# EAGLE design Smart Light Panel4 (EAGLE 8.4.3)
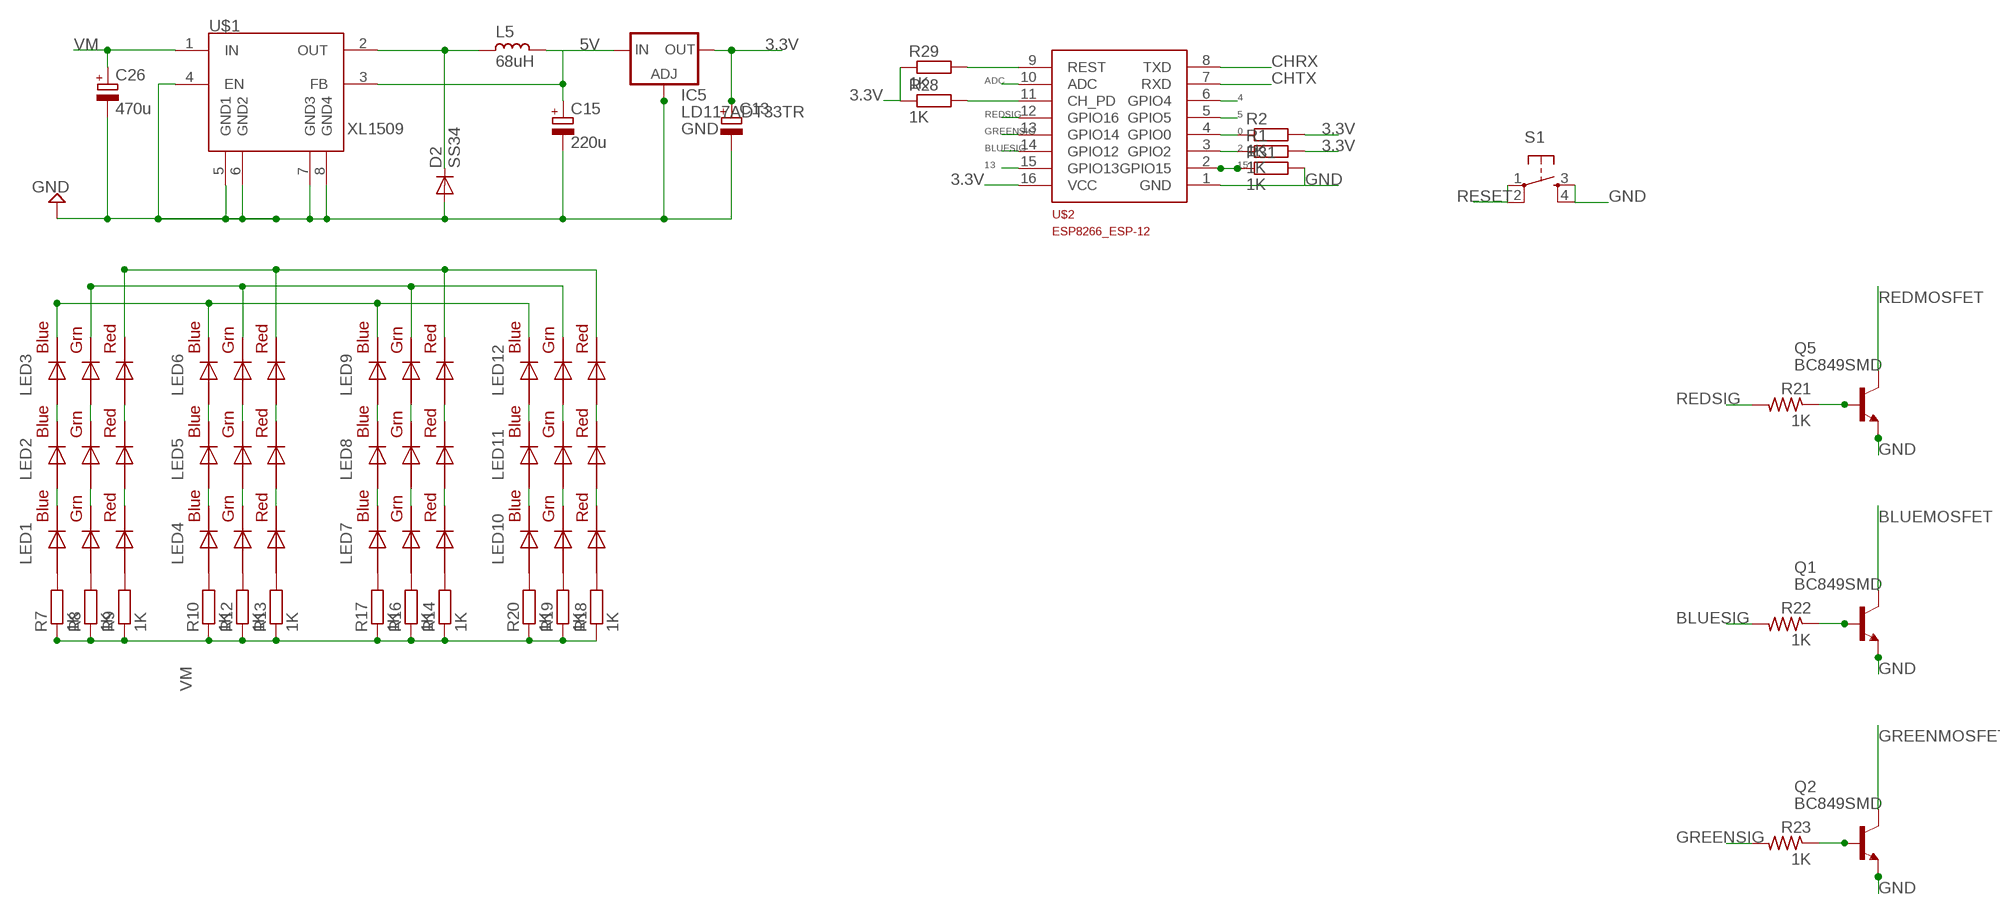
[diagram p0: schematic, sheet 1]

## Parts
C13  CPOL-EUE2.5-7  [E2,5-7]
C15  220u  CPOL-EUE2.5-7  [E2,5-7]
C26  470u  CPOL-EUE2.5-7  [E2,5-7]
D2  SS34  DIODE-DO-214AC  [DO-214AC]
IC5  LD117ADT33TR  [DPACK]
L5  68uH  L_CD75  [CD75]
LED1  RGBLED5050  [RGBLED5050]
LED2  RGBLED5050  [RGBLED5050]
LED3  RGBLED5050  [RGBLED5050]
LED4  RGBLED5050  [RGBLED5050]
LED5  RGBLED5050  [RGBLED5050]
LED6  RGBLED5050  [RGBLED5050]
LED7  RGBLED5050  [RGBLED5050]
LED8  RGBLED5050  [RGBLED5050]
LED9  RGBLED5050  [RGBLED5050]
LED10  RGBLED5050  [RGBLED5050]
LED11  RGBLED5050  [RGBLED5050]
LED12  RGBLED5050  [RGBLED5050]
Q1  BC849SMD  [SOT23-BEC]
Q2  BC849SMD  [SOT23-BEC]
Q5  BC849SMD  [SOT23-BEC]
R1  1K  R-EU_M1206  [M1206]
R2  1K  R-EU_M1206  [M1206]
R7  1K  R-EU_R1206  [R1206]
R8  1K  R-EU_R1206  [R1206]
R9  1K  R-EU_R1206  [R1206]
R10  1K  R-EU_R1206  [R1206]
R12  1K  R-EU_R1206  [R1206]
R13  1K  R-EU_R1206  [R1206]
R14  1K  R-EU_R1206  [R1206]
R16  1K  R-EU_R1206  [R1206]
R17  1K  R-EU_R1206  [R1206]
R18  1K  R-EU_R1206  [R1206]
R19  1K  R-EU_R1206  [R1206]
R20  1K  R-EU_R1206  [R1206]
R21  1K  R-US_M1206  [M1206]
R22  1K  R-US_M1206  [M1206]
R23  1K  R-US_M1206  [M1206]
R28  1K  R-EU_M1206  [M1206]
R29  1K  R-EU_M1206  [M1206]
R31  1K  R-EU_M1206  [M1206]
S1  TAC_SWITCHPTH  [TACTILE-PTH]
U$1  XL1509  [SO08]
U$2  ESP8266_ESP-12  [ESP8266-ESP12]

## Nets
0: R2.1 U$2.4(GPIO0)
2: R1.1 U$2.3(GPIO2)
3.3V: C13.+ IC5.4(OUT) R1.2 R2.2 R28.1 R29.1 U$2.16(VCC)
4: U$2.6(GPIO4)
5: U$2.5(GPIO5)
5V: C15.+ IC5.3(IN) L5.1 U$1.3(FB)
13: U$2.15(GPIO13)
15: R31.1 U$2.2(GPIO15)
ADC: U$2.10(ADC)
BLUEMOSFET: LED3.4(BLUE_C) LED6.4(BLUE_C) LED9.4(BLUE_C) LED12.4(BLUE_C) Q1.C
BLUESIG: R22.2 U$2.14(GPIO12)
CHRX: U$2.8(TXD)
CHTX: U$2.7(RXD)
GND: C13.- C15.- C26.- D2.2(A) IC5.1(ADJ) Q1.E Q2.E Q5.E R31.2 S1.3 S1.4 U$1.4(EN) U$1.5(GND1) U$1.6(GND2) U$1.7(GND3) U$1.8(GND4) U$2.1(GND)
GREENMOSFET: LED3.6(GREEN_C) LED6.6(GREEN_C) LED9.6(GREEN_C) LED12.6(GREEN_C) Q2.C
GREENSIG: R23.2 U$2.13(GPIO14)
N$2: LED2.4(BLUE_C) LED3.3(BLUE_A)
N$3: LED2.6(GREEN_C) LED3.1(GREEN_A)
N$5: Q1.B R22.1
N$6: LED2.5(RED_C) LED3.2(RED_A)
N$7: LED1.5(RED_C) LED2.2(RED_A)
N$8: Q2.B R23.1
N$11: LED1.6(GREEN_C) LED2.1(GREEN_A)
N$14: LED1.4(BLUE_C) LED2.3(BLUE_A)
N$15: LED4.4(BLUE_C) LED5.3(BLUE_A)
N$16: LED4.6(GREEN_C) LED5.1(GREEN_A)
N$17: LED5.4(BLUE_C) LED6.3(BLUE_A)
N$18: R28.2 U$2.11(CH_PD)
N$19: LED5.6(GREEN_C) LED6.1(GREEN_A)
N$20: LED4.5(RED_C) LED5.2(RED_A)
N$21: LED5.5(RED_C) LED6.2(RED_A)
N$22: LED7.4(BLUE_C) LED8.3(BLUE_A)
N$23: LED8.4(BLUE_C) LED9.3(BLUE_A)
N$24: LED7.6(GREEN_C) LED8.1(GREEN_A)
N$25: LED8.6(GREEN_C) LED9.1(GREEN_A)
N$26: LED7.5(RED_C) LED8.2(RED_A)
N$27: LED8.5(RED_C) LED9.2(RED_A)
N$28: LED10.4(BLUE_C) LED11.3(BLUE_A)
N$29: LED11.4(BLUE_C) LED12.3(BLUE_A)
N$30: LED10.6(GREEN_C) LED11.1(GREEN_A)
N$31: LED11.6(GREEN_C) LED12.1(GREEN_A)
N$32: LED10.5(RED_C) LED11.2(RED_A)
N$33: LED11.5(RED_C) LED12.2(RED_A)
N$42: Q5.B R21.1
N$92: D2.1(C) L5.2 U$1.2(OUT)
N$177: LED1.3(BLUE_A) R7.2
N$178: LED1.1(GREEN_A) R8.2
N$179: LED1.2(RED_A) R9.2
N$180: LED4.3(BLUE_A) R10.2
N$181: LED4.1(GREEN_A) R12.2
N$182: LED4.2(RED_A) R13.2
N$183: LED7.2(RED_A) R14.2
N$184: LED7.1(GREEN_A) R16.2
N$185: LED7.3(BLUE_A) R17.2
N$186: LED10.2(RED_A) R18.2
N$187: LED10.1(GREEN_A) R19.2
N$188: LED10.3(BLUE_A) R20.2
REDMOSFET: LED3.5(RED_C) LED6.5(RED_C) LED9.5(RED_C) LED12.5(RED_C) Q5.C
REDSIG: R21.2 U$2.12(GPIO16)
RESET: R29.2 S1.1 S1.2 U$2.9(REST)
VM: C26.+ R7.1 R8.1 R9.1 R10.1 R12.1 R13.1 R14.1 R16.1 R17.1 R18.1 R19.1 R20.1 U$1.1(IN)

## Library data of the parts
C13 C15 C26 = rcl:CPOL-EU: POLARIZED CAPACITOR, European symbol
D2 = dp_devices:DIODE: Various Diode Packages
IC5 = v-reg:LD117A?*: Low drop fixed and adjustable positive voltage regulators 1 A Source: http://www.st.com/stonline/products/literature/ds/7194/ld1117axx.pdf
L5 = rc-master-smd:L_: INDUCTOR
LED1-LED12 = adafruit:RGBLED: For 5050 RGB LEDs, the order of the LEDs may vary from one manufacturer to another!
Q1 Q2 Q5 = transistor-npn:BC849*: NPN Transistor
R1 R2 R7-R10 R12-R14 R16-R20 R28 R29 R31 = rcl:R-EU_: RESISTOR, European symbol
R21-R23 = adafruit:R-US_: RESISTOR, American symbol
S1 = SparkFun:TAC_SWITCH: Momentary Switch Button commonly used for reset or general input. Spark Fun Electronics SKU : COM-00097
U$1 = Cohesion_parts:XL1509
U$2 = ESP8266-ESP12:ESP8266_ESP-12: ESP8266 ESP-12 Discussion about pins here: http://www.esp8266.com/viewtopic.php?f=13&t=1429

## Net classes
1 power: width 0.6 mm, clearance 0.305 mm

## Board
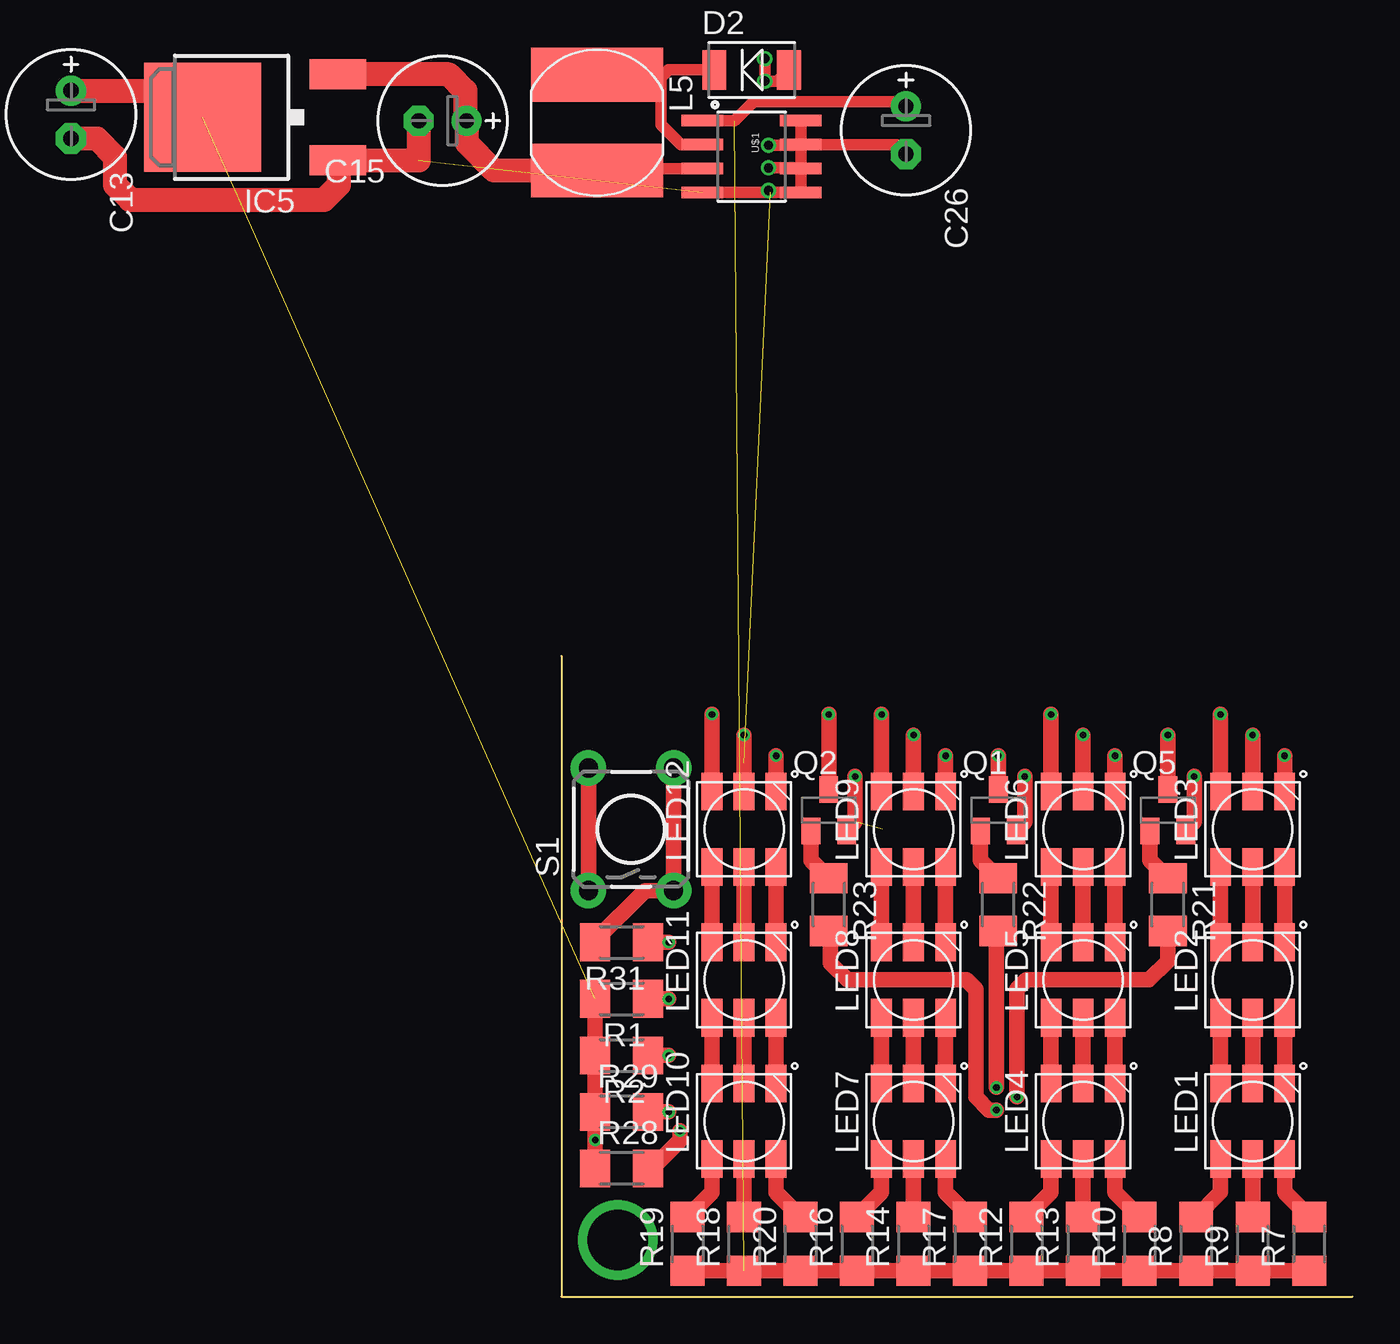
[diagram p1: board, top side]
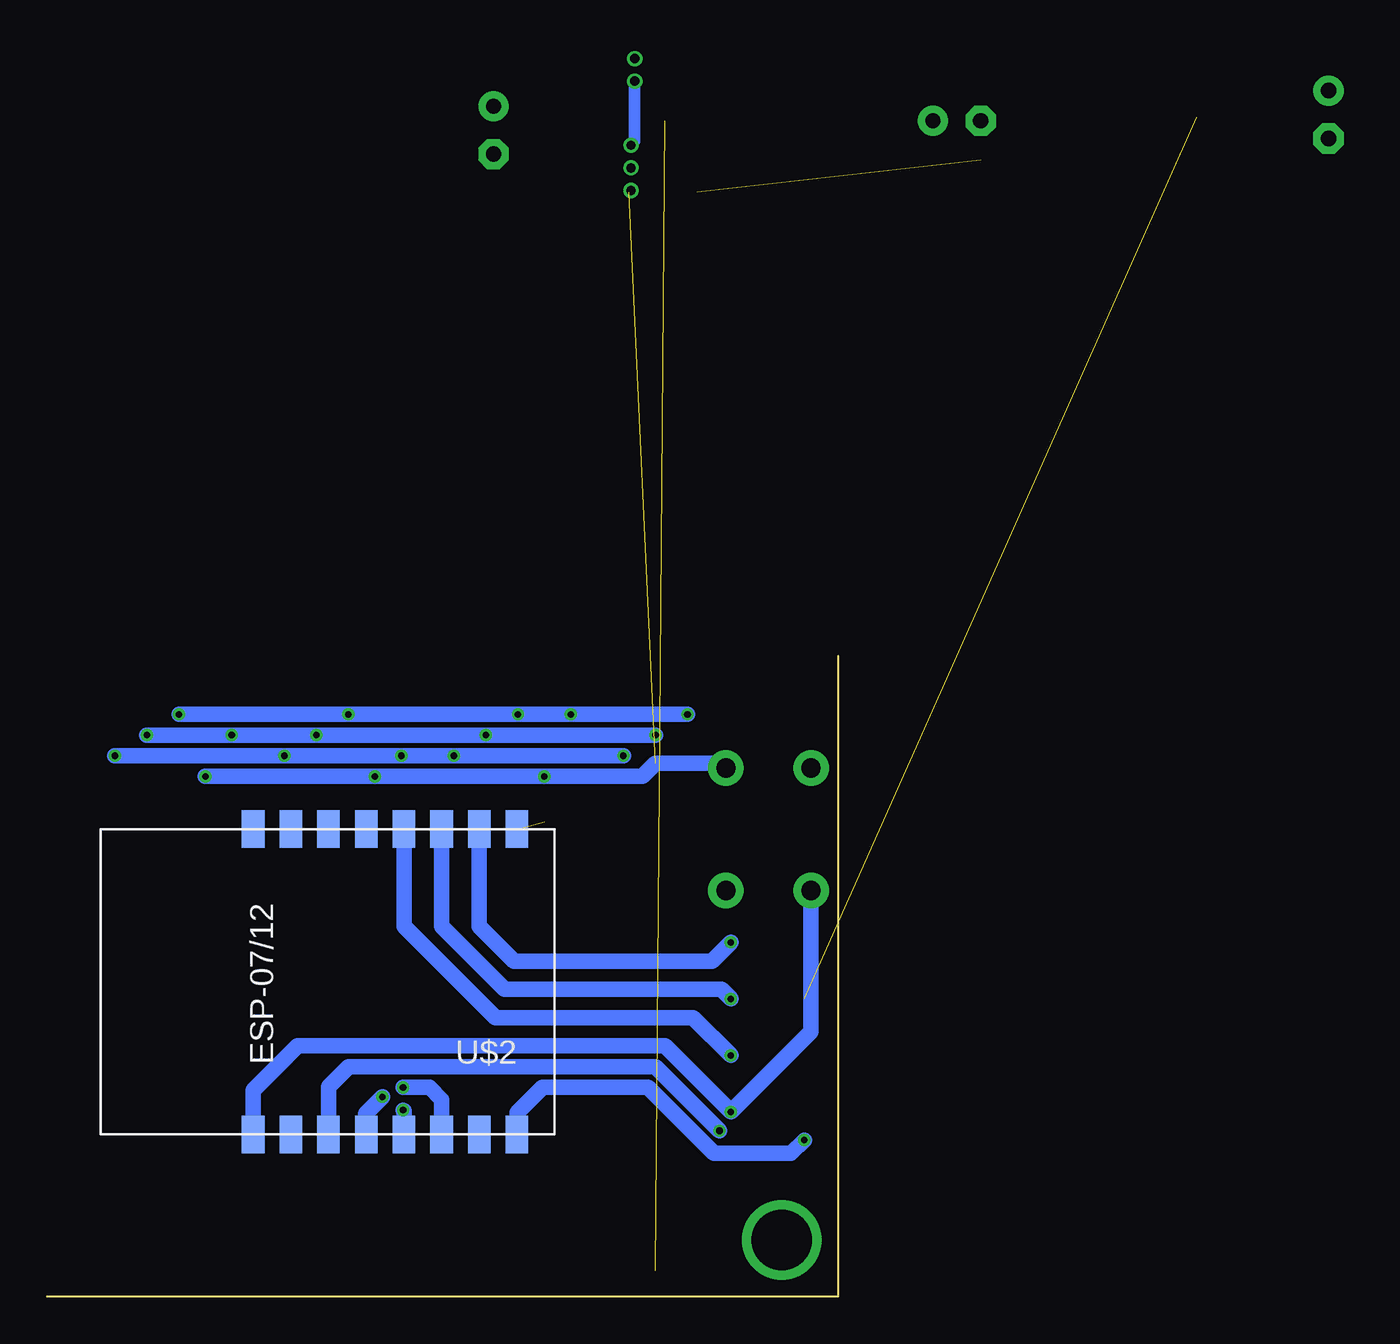
[diagram p2: board, bottom side, seen from below]

Size 42 x 34 mm. Coordinates in mm from the lower left corner, seen from the top.
Outline: 42,0 0,0 0,34
Copper layers (1*16): Top 0.035mm / dielectric 1.5mm / Bottom 0.035mm
Design rules "dirt_cheap_dirty_boards.v1": minimum track width 5mil, minimum drill 12mil, track to track 5mil, track to pad 5mil, pad to pad 5mil, via to via 5mil, smd to smd 0mil, copper to edge 10mil, drill to drill 10mil, minimum pad ring 10mil, minimum via ring 6mil, stop-mask expansion 2mil, vias tented up to drill 25mil, thermal gap 10mil

### Footprints (pad centres in the part's own frame; a part is rotated, then mirrored left to right if it is on the bottom)
E2,5-7 = drill 0.813 pad 1.6: + -1.27,0 | drill 0.813 pad 1.6 octagon: - 1.27,0
DO-214AC = smd 1.27 x 2.1: 1 -1.98,0; 2 1.98,0
DPACK = smd 1.6 x 3: 1 -2.28,-4.8; 3 2.28,-4.8 | smd 5.8 x 6.2: 4 0,2.38
CD75 = smd 7 x 2.85: 1 0,2.54; 2 0,-2.54
RGBLED5050 = smd 2 x 1.1: 1 -2,1.7; 2 -2,0; 3 -2,-1.7; 4 2,-1.7; 5 2,0; 6 2,1.7
SOT23-BEC = smd 1 x 1.4: B -0.95,-1.1; C 0,1.1; E 0.95,-1.1
M1206 = smd 1.6 x 2: 1 -1.4,0; 2 1.4,0
R1206 = smd 1.6 x 1.803: 1 -1.422,0; 2 1.422,0
TACTILE-PTH = drill 1.016 pad 1.88: 1 -3.251,2.261; 2 3.251,2.261; 3 -3.251,-2.261; 4 3.251,-2.261
SO08 = smd 0.61 x 2.21: 1 -1.905,-2.616; 2 -0.635,-2.616; 3 0.635,-2.616; 4 1.905,-2.616; 5 1.905,2.616; 6 0.635,2.616; 7 -0.635,2.616; 8 -1.905,2.616
ESP8266-ESP12 = smd 2 x 1.2: 1 16.2,2; 2 16.2,4; 3 16.2,6; 4 16.2,8; 5 16.2,10; 6 16.2,12; 7 16.2,14; 8 16.2,16; 9 0,16; 10 0,14; 11 0,12; 12 0,10; 13 0,8; 14 0,6; 15 0,4; 16 0,2

### Placement (x,y rotation side)
C13  -26.03,62.73 270 top  (outside the outline)
C15  -6.3,62.4 180 top  (outside the outline)
C26  18.3,61.9 270 top  (outside the outline)
D2  10.1,65.1 0 top  (outside the outline)
IC5  -16.67,62.59 90 top  (outside the outline)
L5  1.9,62.3 180 top  (outside the outline)
LED1  36.7,9.3 90 top
LED2  36.7,16.8 90 top
LED3  36.7,24.8 90 top
LED4  27.7,9.3 90 top
LED5  27.7,16.8 90 top
LED6  27.7,24.8 90 top
LED7  18.7,9.3 90 top
LED8  18.7,16.8 90 top
LED9  18.7,24.8 90 top
LED10  9.7,9.3 90 top
LED11  9.7,16.8 90 top
LED12  9.7,24.8 90 top
Q1  23.2,25.8 0 top
Q2  14.2,25.8 0 top
Q5  32.2,25.8 0 top
R1  3.2,15.8 180 top
R2  3.2,12.8 180 top
R7  39.7,2.8 90 top
R8  33.7,2.8 90 top
R9  36.7,2.8 90 top
R10  30.7,2.8 90 top
R12  24.7,2.8 90 top
R13  27.7,2.8 90 top
R14  18.7,2.8 90 top
R16  15.7,2.8 90 top
R17  21.7,2.8 90 top
R18  9.7,2.8 90 top
R19  6.7,2.8 90 top
R20  12.7,2.8 90 top
R21  32.2,20.8 270 top
R22  23.2,20.8 270 top
R23  14.2,20.8 270 top
R28  3.2,6.8 0 top
R29  3.2,9.8 0 top
R31  3.2,18.8 180 top
S1  3.7,24.8 90 top
U$1  10.1,60.5 270 top  (outside the outline)
U$2  15.06,8.61 90 bottom

### Tracks (layer width: path | path; a pad name or v marks a point on that pad's centre or on a via)
0  (via drill 0.35)
  Top 0.813: R2.1 v5.7,12.8
  Bottom 0.813: v5.7,12.8 7.7,14.8 18.2,14.8 23.06,19.66 U$2.4
2  (via drill 0.35)
  Top 0.813: R1.1 v5.7,15.8
  Bottom 0.813: v5.7,15.8 6.2,16.3 17.7,16.3 21.06,19.66 U$2.3
3.3V  (via drill 0.35)  (1 unrouted)
  Top 0.813: R28.1 v1.8,8.3 R29.1 R2.2 R1.2
  Top 1.27: C13.+ -20.46,64 IC5.4
  Bottom 0.813: U$2.16 17.06,9.74 15.7,11.1 10.1,11.1 6.6,7.6 2.5,7.6 v1.8,8.3
5V
  Top 0.61: U$1.3 2,59.87 L5.1
  Top 1.27: L5.1 -3.56,59.76 -5,61.2 -5,62.37 C15.+ -5.1,62.47 -5.1,64 -5.96,64.86 IC5.3
15  (via drill 0.35)
  Top 0.813: R31.1 v5.7,18.8
  Bottom 0.813: v5.7,18.8 6.7,17.8 17.2,17.8 19.06,19.66 U$2.2
BLUEMOSFET  (via drill 0.35)
  Top 0.813: LED12.4 v11.4,28.7 | LED9.4 v20.4,28.7 | LED6.4 v29.4,28.7 | LED3.4 v38.4,28.7 | Q1.C v23.2,28.7
  Bottom 0.813: v38.4,28.7 v29.4,28.7 v23.2,28.7 v20.4,28.7 v11.4,28.7
BLUESIG  (via drill 0.35)
  Top 0.813: R22.2 23.1,19.3 v23.1,11.1
  Bottom 0.813: v23.1,11.1 21.7,11.1 21.06,10.46 U$2.14
GND  (via drill 0.35, 0.5)  (3 unrouted)
  Top 0.61: U$1.7 17.8,61.13 C26.- | U$1.4 10.89,58.59 v11,58.7 11.11,58.59 U$1.5 U$1.6 | U$1.7 U$1.6 | U$1.8 U$1.7 | v11,61.1 12.68,61.1 U$1.7 | v11,59.9 12.68,59.9 U$1.6 | v10.8,65.7 v10.8,64.5 11.48,64.5 D2.2
  Top 0.813: Q5.E 33.15,24.75 33.6,25.2 v33.6,27.6 | Q2.E 15.15,24.75 15.6,25.2 v15.6,27.6 | Q1.E 24.15,24.75 24.6,25.2 v24.6,27.6 | R31.2 1.8,18.9 4.45,21.55 S1.3 S1.4
  Top 1.27: C15.- -7.57,60.3 -7.58,60.3 IC5.1 -11.8,60.24 -11.8,59 -12.6,58.2 -22.9,58.2 -23.7,59 -23.7,60.5 -24.66,61.46 C13.-
  Bottom 0.61: v11,61.1 10.8,61.3 v10.8,64.5 10.8,64.6
  Bottom 0.813: v33.6,27.6 v24.6,27.6 v15.6,27.6 10.4,27.6 9.7,28.3 6.21,28.3 S1.4
GREENMOSFET  (via drill 0.35)
  Top 0.813: LED12.6 v8,30.9 | LED9.6 v17,30.9 | LED6.6 v26,30.9 | LED3.6 v35,30.9 | Q2.C v14.2,30.9
  Bottom 0.813: v35,30.9 v26,30.9 v17,30.9 v14.2,30.9 v8,30.9
GREENSIG  (via drill 0.35)
  Top 0.813: R23.2 14.3,19.3 14.3,17.7 15.2,16.8 21.5,16.8 22,16.3 22,10.6 22.7,9.9 v23.1,9.9
  Bottom 0.813: v23.1,9.9 23.06,9.86 U$2.13
N$1  (via drill 3.2 pad 4)
  other vias: 3,3
N$2
  Top 0.813: LED3.3 LED2.4
N$3
  Top 0.813: LED3.1 LED2.6
N$5
  Top 0.813: Q1.B 22.25,23.15 R22.1
N$6
  Top 0.813: LED3.2 LED2.5
N$7
  Top 0.813: LED2.2 LED1.5
N$8
  Top 0.813: Q2.B 13.25,23.15 R23.1
N$11
  Top 0.813: LED2.1 LED1.6
N$14
  Top 0.813: LED2.3 LED1.4
N$15
  Top 0.813: LED5.3 LED4.4
N$16
  Top 0.813: LED5.1 LED4.6
N$17
  Top 0.813: LED6.3 LED5.4
N$18  (via drill 0.35)
  Top 0.813: R28.2 4.6,6.9 4.9,6.9 6.3,8.3 v6.3,8.8
  Bottom 0.813: U$2.11 27.06,11.14 26,12.2 9.7,12.2 v6.3,8.8
N$19
  Top 0.813: LED6.1 LED5.6
N$20
  Top 0.813: LED5.2 LED4.5
N$21
  Top 0.813: LED6.2 LED5.5
N$22
  Top 0.813: LED8.3 LED7.4
N$23
  Top 0.813: LED9.3 LED8.4
N$24
  Top 0.813: LED8.1 LED7.6
N$25
  Top 0.813: LED9.1 LED8.6
N$26
  Top 0.813: LED8.2 LED7.5
N$27
  Top 0.813: LED9.2 LED8.5
N$28
  Top 0.813: LED11.3 LED10.4
N$29
  Top 0.813: LED12.3 LED11.4
N$30
  Top 0.813: LED11.1 LED10.6
N$31
  Top 0.813: LED12.1 LED11.6
N$32
  Top 0.813: LED11.2 LED10.5
N$33
  Top 0.813: LED12.2 LED11.5
N$42
  Top 0.813: Q5.B 31.25,23.15 R21.1
N$92
  Top 0.61: U$1.2 6.37,61.13 5.3,62.2 5.3,64.7 | 5.3,64.7 5.2,64.8 1.94,64.8 L5.2 | D2.1 5.7,65.1 5.3,64.7
N$177
  Top 0.813: LED1.3 38.4,5.52 R7.2
N$178
  Top 0.813: LED1.1 35,5.52 R8.2
N$179
  Top 0.813: LED1.2 R9.2
N$180
  Top 0.813: LED4.3 29.4,5.52 R10.2
N$181
  Top 0.813: LED4.1 26,5.52 R12.2
N$182
  Top 0.813: LED4.2 R13.2
N$183
  Top 0.813: LED7.2 R14.2
N$184
  Top 0.813: LED7.1 17,5.52 R16.2
N$185
  Top 0.813: LED7.3 20.4,5.52 R17.2
N$186
  Top 0.813: LED10.2 R18.2
N$187
  Top 0.813: LED10.1 8,5.52 R19.2
N$188
  Top 0.813: LED10.3 11.4,5.52 R20.2
REDMOSFET  (via drill 0.35)
  Top 0.813: LED12.5 v9.7,29.8 | LED9.5 v18.7,29.8 | LED6.5 v27.7,29.8 | LED3.5 v36.7,29.8 | Q5.C v32.2,29.8
  Bottom 0.813: v36.7,29.8 v32.2,29.8 v27.7,29.8 v18.7,29.8 v9.7,29.8
REDSIG  (via drill 0.35)
  Top 0.813: R21.2 32.2,17.8 31.2,16.8 24.7,16.8 24.2,16.3 v24.2,10.6
  Bottom 0.813: U$2.12 25.1,8.75 25.1,9.7 v24.2,10.6
RESET  (via drill 0.35)
  Top 0.813: R29.2 v5.7,9.8 | S1.1 S1.2
  Bottom 0.813: U$2.9 31.06,10.94 28.7,13.3 9.2,13.3 v5.7,9.8 1.44,14.06 S1.1
VM  (1 unrouted)
  Top 0.61: U$1.1 9.21,62.41 10.2,63.4 18.07,63.4 C26.+
  Top 0.813: R7.1 R9.1 R8.1 R10.1 R13.1 R12.1 R17.1 R14.1 R16.1 R20.1 R18.1 R19.1